# EAGLE schematic R2P_Proximity_module (EAGLE 6.4)
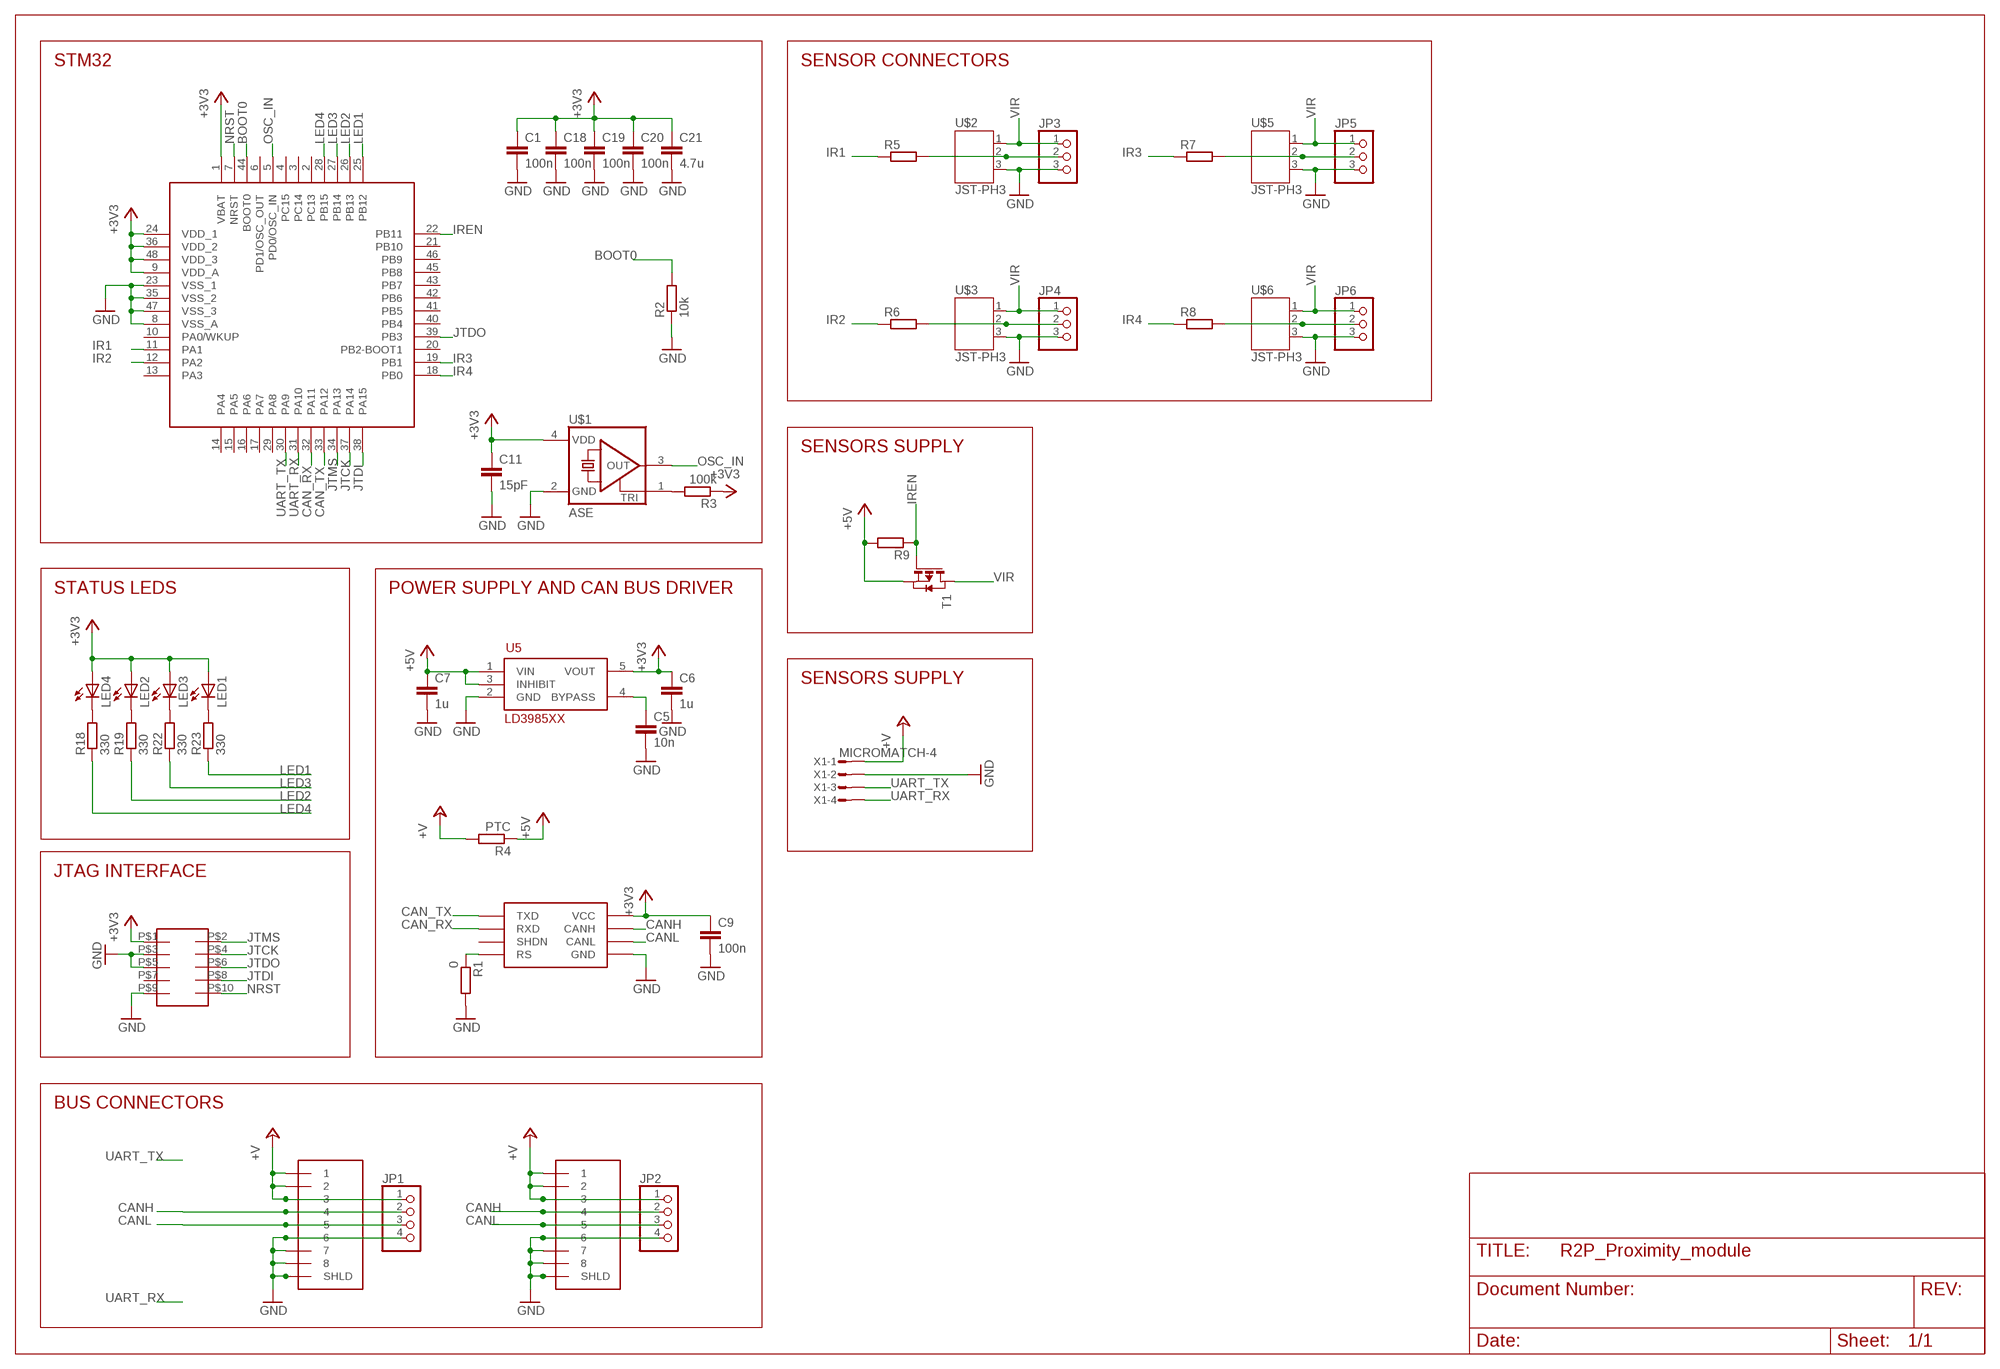
[diagram p0: schematic, sheet 1]

## Parts
1  RJ45-43860  [0438600010]
2  RJ45-43860  [0438600010]
C1  100n  C-EUC0603  [C0603]
C5  10n  C-EUC0603  [C0603]
C6  1u  C-EUC0603  [C0603]
C7  1u  C-EUC0603  [C0603]
C9  100n  C-EUC0603  [C0603]
C11  15pF  C-EUC0603  [C0603]
C18  100n  C-EUC0603  [C0603]
C19  100n  C-EUC0603  [C0603]
C20  100n  C-EUC0603  [C0603]
C21  4.7u  C-EUC0805  [C0805]
JP1  PINHD-1X4  [1X04]
JP2  PINHD-1X4  [1X04]
JP3  PINHD-1X3  [1X03]
JP4  PINHD-1X3  [1X03]
JP5  PINHD-1X3  [1X03]
JP6  PINHD-1X3  [1X03]
LED1  LEDCHIPLED_0805  [CHIPLED_0805]
LED2  LEDCHIPLED_0805  [CHIPLED_0805]
LED3  LEDCHIPLED_0805  [CHIPLED_0805]
LED4  LEDCHIPLED_0805  [CHIPLED_0805]
R1  0  R-EU_R0603  [R0603]
R2  10k  R-EU_R0603  [R0603]
R3  100k  R-EU_R0603  [R0603]
R4  PTC  R-EU_R0603  [R0603]
R5  R-EU_R0603  [R0603]
R6  R-EU_R0603  [R0603]
R7  R-EU_R0603  [R0603]
R8  R-EU_R0603  [R0603]
R9  R-EU_R0603  [R0603]
R18  330  R-EU_R0603  [R0603]
R19  330  R-EU_R0603  [R0603]
R22  330  R-EU_R0603  [R0603]
R23  330  R-EU_R0603  [R0603]
SOT1  MAX3051  [SOT23-8L]
T1  PMOSSOT23  [SOT-23]
U1  STM32F103CX  [LQFP48]
U5  LD3985XX  [SOT23-5L]
U$1  ASE  [ASE]
U$2  JST-PH3  [JST-PH3]
U$3  JST-PH3  [JST-PH3]
U$4  FTSH-105  [FTSH-105]
U$5  JST-PH3  [JST-PH3]
U$6  JST-PH3  [JST-PH3]
X1  MICROMATCH-4  [MICROMATCH-4]

## Nets
+3V3: C1.1 C6.1 C9.1 C11.1 C18.1 C19.1 C20.1 C21.1 LED1.A LED2.A LED3.A LED4.A R3.1 SOT1.P$3(VCC) U1.1(VBAT) U1.9(VDD_A) U1.24(VDD_1) U1.36(VDD_2) U1.48(VDD_3) U5.5(VOUT) U$1.4(VDD) U$4.P$1
+5V: C7.1 R4.1 R9.2 T1.2(S) U5.1(VIN) U5.3(INHIBIT)
+V: 1.P$1 1.P$2 1.P$3 2.P$1 2.P$2 2.P$3 JP1.1 JP2.1 R4.2 X1.1
BOOT0: R2.2 U1.44(BOOT0)
CAN_RX: SOT1.P$4(RXD) U1.32(PA11)
CAN_TX: SOT1.P$1(TXD) U1.33(PA12)
CANH: 1.P$4 2.P$4 JP1.2 JP2.2 SOT1.P$7(CANH)
CANL: 1.P$5 2.P$5 JP1.3 JP2.3 SOT1.P$6(CANL)
GND: 1.P$6 1.P$7 1.P$8 1.P$9(SHLD) 1.P$10 2.P$6 2.P$7 2.P$8 2.P$9(SHLD) 2.P$10 C1.2 C5.2 C6.2 C7.2 C9.2 C11.2 C18.2 C19.2 C20.2 C21.2 JP1.4 JP2.4 JP3.3 JP4.3 JP5.3 JP6.3 R1.2 R2.1 SOT1.P$2(GND) U1.8(VSS_A) U1.23(VSS_1) U1.35(VSS_2) U1.47(VSS_3) U5.2(GND) U$1.2(GND) U$2.3 U$3.3 U$4.P$3 U$4.P$5 U$4.P$9 U$5.3 U$6.3 X1.2
IR1: R5.1 U1.11(PA1)
IR2: R6.1 U1.12(PA2)
IR3: R7.1 U1.19(PB1)
IR4: R8.1 U1.18(PB0)
IREN: R9.1 T1.3(G) U1.22(PB11)
JTCK: U1.37(PA14) U$4.P$4
JTDI: U1.38(PA15) U$4.P$8
JTDO: U1.39(PB3) U$4.P$6
JTMS: U1.34(PA13) U$4.P$2
LED1: R23.1 U1.25(PB12)
LED2: R19.1 U1.26(PB13)
LED3: R22.1 U1.27(PB14)
LED4: R18.1 U1.28(PB15)
N$2: R1.1 SOT1.P$8(RS)
N$3: R3.2 U$1.1(TRI)
N$4: C5.1 U5.4(BYPASS)
N$5: JP3.2 R5.2 U$2.2
N$6: JP4.2 R6.2 U$3.2
N$7: JP6.2 R8.2 U$6.2
N$8: JP5.2 R7.2 U$5.2
N$15: LED4.C R18.2
N$18: LED2.C R19.2
N$20: LED3.C R22.2
N$22: LED1.C R23.2
NRST: U1.7(NRST) U$4.P$10
OSC_IN: U1.5(PD0/OSC_IN) U$1.3(OUT)
UART_RX: U1.31(PA10) X1.4
UART_TX: U1.30(PA9) X1.3
VIR: JP3.1 JP4.1 JP5.1 JP6.1 T1.1(D) U$2.1 U$3.1 U$5.1 U$6.1
Unconnected: SOT1.P$5(SHDN) U1.2(PC13) U1.3(PC14) U1.4(PC15) U1.6(PD1/OSC_OUT) U1.10(PA0/WKUP) U1.13(PA3) U1.14(PA4) U1.15(PA5) U1.16(PA6) U1.17(PA7) U1.20(PB2-BOOT1) U1.21(PB10) U1.29(PA8) U1.40(PB4) U1.41(PB5) U1.42(PB6) U1.43(PB7) U1.45(PB8) U1.46(PB9) U$4.P$7

## Notes on the sheet
- STM32 | SENSOR CONNECTORS
- SENSORS SUPPLY
- STATUS LEDS | POWER SUPPLY AND CAN BUS DRIVER
- SENSORS SUPPLY
- JTAG INTERFACE
- BUS CONNECTORS

## Library data of the parts
1 2 = molex:RJ45-43860
C1 C5-C7 C9 C11 C18-C21 = rcl:C-EU: CAPACITOR, European symbol
JP1 JP2 = misc:PINHD-1X4: PIN HEADER
JP3-JP6 = misc:PINHD-1X3: PIN HEADER
LED1-LED4 = led:LED: LED OSRAM: - CHIPLED LG R971, LG N971, LY N971, LG Q971, LY Q971, LO R971, LY R971 LH N974, LH R974 LS Q976, LO Q976, LY Q976 LO Q996 - Hyper CHIPLED LW Q18S LB Q993, LB Q99A, LB R99A - SideLED LS A670, LO A670, LY A670, LG A670, LP A670 LB A673, LV A673, LT A673, LW A673 LH A674 LY A675 LS A676, LA A676, LO A676, LY A676, LW A676 LS A679, LY A679, LG A679 - Hyper Micro SIDELED® LS Y876, LA Y876, LO Y876, LY Y876 LT Y87S - SmartLED LW L88C, LW L88S LB L89C, LB L89S, LG L890 LS L89K, LO L89K, LY L89K LS L896, LA L896, LO L896, LY L896 - TOPLED LS T670, LO T670, LY T670, LG T670, LP T670 LSG T670, LSP T670, LSY T670, LOP T670, LYG T670 LG T671, LOG T671, LSG T671 LB T673, LV T673, LT T673, LW T673 LH T674 LS T676, LA T676, LO T676, LY T676, LB T676, LH T676, LSB T676, LW T676 LB T67C, LV T67C, LT T67C, LS T67K, LO T67K, LY T67K, LW E67C LS E67B, LA E67B, LO E67B, LY E67B, LB E67C, LV E67C, LT E67C LW T67C LS T679, LY T679, LG T679 LS T770, LO T770, LY T770, LG T770, LP T770 LB T773, LV T773, LT T773, LW T773 LH T774 LS E675, LA E675, LY E675, LS T675 LS T776, LA T776, LO T776, LY T776, LB T776 LHGB T686 LT T68C, LB T68C - Hyper Mini TOPLED® LB M676 - Mini TOPLED Santana® LG M470 LS M47K, LO M47K, LY M47K Source: http://www.osram.convergy.de LUXEON: - LUMILED® LXK2-PW12-R00, LXK2-PW12-S00, LXK2-PW14-U00, LXK2-PW14-V00 LXK2-PM12-R00, LXK2-PM12-S00, LXK2-PM14-U00 LXK2-PE12-Q00, LXK2-PE12-R00, LXK2-PE12-S00, LXK2-PE14-T00, LXK2-PE14-U00 LXK2-PB12-K00, LXK2-PB12-L00, LXK2-PB12-M00, LXK2-PB14-N00, LXK2-PB14-P00, LXK2-PB14-Q00 LXK2-PR12-L00, LXK2-PR12-M00, LXK2-PR14-Q00, LXK2-PR14-R00 LXK2-PD12-Q00, LXK2-PD12-R00, LXK2-PD12-S00 LXK2-PH12-R00, LXK2-PH12-S00 LXK2-PL12-P00, LXK2-PL12-Q00, LXK2-PL12-R00 Source: www.luxeon.com KINGBRIGHT: KA-3528ASYC Source: www.kingbright.com
R1-R9 R18 R19 R22 R23 = rcl:R-EU_: RESISTOR, European symbol
SOT1 = maxim:MAX3051
T1 = zetex:PMOSSOT23: MOS FET; OC_FARNELL: unknown; OC_NEWARK: unknown
U1 = st:STM32F103CX
U5 = st:LD3985XX
U$1 = crystal:ASE: 3.3Vdc CMOS SMD CRYSTAL CLOCK OSCILLATOR SOurce: www.abracon.com; OC_FARNELL: unknown; OC_NEWARK: unknown
U$2 U$3 U$5 U$6 = jst:JST-PH3
U$4 = samtec:FTSH-105
X1 = tyco:MICROMATCH-4: MicroMaTch 4